# Altium schematic sheet Power Supply.SchDoc: Power Supply
size A4; Organization: Altium Limited; Address1: L3, 12a Rodborough Rd; Address2: Frenchs Forest; Address3: NSW; Address4: Australia 2086; Revision: 1; SheetNumber: 2; SheetTotal: 11; Alumno: Diego Caceres; Curso: R1051; Materia: Sistemas de Representación; Docentes: Ing. Perdomo, Ing. Fuoco, Ing. Giorno, Sr. Vergili
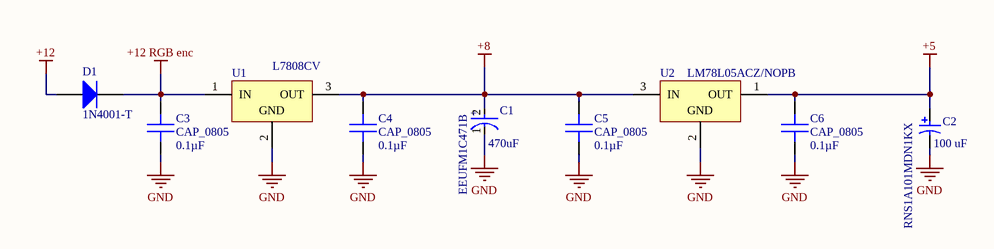
[diagram p0: Power Supply.SchDoc]

## Parts
C1  EEUFM1C471B  Capacitance: 470uF  [FP-RAD-TH-D_10_0_5-L_12_5-MFG]
C2  RNS1A101MDN1KX  Rated Capacitance: 100 uF  [NIC-RNS-8x11.5-2_V]
C3  CAP_0805  value 0.1µF  [0805_CAPACITOR_DCACERES]
C4  CAP_0805  value 0.1µF  [0805_CAPACITOR_DCACERES]
C5  CAP_0805  value 0.1µF  [0805_CAPACITOR_DCACERES]
C6  CAP_0805  value 0.1µF  [0805_CAPACITOR_DCACERES]
D1  1N4001-T  [DIOD-DO-41-P-2_V]
U1  L7808CV  [TO220]
U2  LM78L05ACZ/NOPB  [LP0003A]

## Nets
+5: C2.1 C6.1 U2.1(OUT)
+8: C1.2(A) C4.1 C5.1 U1.3(OUT) U2.3(IN)
+12: D1.1(A)
+12 RGB enc: C3.1 D1.2(K) U1.1(IN)
GND: C1.1(C) C2.2 C3.2 C4.2 C5.2 C6.2 U1.2(GND) U2.2(GND)

## Notes on the sheet
- Title:
- Revision:
- Alumno:
- Materia:
- Docentes:
- Curso:
- File:
- Date:
- Sheet
- of
- (in symbol CMP-05427-001980-1) +

## Library data of the parts
C1 = CMP-05427-001980-1: Aluminum Electrolytic Capacitors (Radial Lead Type) 470uF ±20% 16V; Ripple Current: 1.29A; ESR (Equivalent Series Resistance): 38mR; Life (Hours): 4000Hour; Lead Diameter: 0.6mm; Height: 12.5mm; Package Quantity: 500; Lead Free: Lead Free; Voltage Rating: 16V; Diameter: 10mm; Radiation Hardening: No; Packaging: Tape and Reel; Case/Package: Radial; Tolerance: 20%; Series: FM; Height - Seated (Max): 0.551inch; Max Operating Temperature: 105°C; Termination: Radial; Mount: Through Hole; RoHS Compliant: Yes; Voltage Rating (DC): 16V; Impedance: 38mR; Length: 12.5mm; Lead Pitch: 5mm; Min Operating Temperature: -40°C
C2 = CMP-1235-00001-1: Aluminum Electrolytic Capacitor, 100 uF +/-20%, 10 V, -55 to 105 degC, 2-Pin THD, RoHS; Manufacturer: Nichicon; Rated Ripple: 3900 mA; Rated Voltage: 10 V; Leakage Current: 0.15 mA; Capacitance Tolerance: +/-20%; ComponentLink1URL: http://www.nichicon.co.jp/; ComponentLink3URL: http://www.nichicon.co.jp/english/products/pdf/2013fpcap_catalog_ns.pdf; ComponentLink1Description: Manufacturer URL; ComponentLink2URL: http://www.nichicon.co.jp/english/products/pdfs/e-ns.pdf; PackageDescription: 2-Pin Through Hole Device, Dia 8 mm, Body Length 11.5 mm, Pin Spacing 3.5 mm; Temperature Range: -55 to 105 degC; ComponentLink3Description: Package Specification; PartNumber: RNS1A101MDN1KX; Mounting Technology: Through Hole; DatasheetVersion: Sep-13; RoHS: TRUE; ComponentLink2Description: Datasheet
C3-C6 = CAPACITOR_0805_Caceres: Capacitor SMD, encapsulado 0805; SizePackage: 0805; ComponentLink1Description: Datasheet1; ComponentLink1URL: https://www.mouser.com/datasheet/2/40/AutoMLCCKAM-3216307.pdf; ComponentLink2Description: Datasheet2; ComponentLink2URL: https://www.mouser.com/datasheet/2/447/KEM_C1086_U2J-3316409.pdf; ComponentLink3Description: Datasheet3; ComponentLink3URL: https://product.tdk.com/system/files/dam/doc/product/capacitor/ceramic/mlcc/catalog/mlcc_commercial_soft_en.pdf
D1 = CMP-0639-00006-2: 1.0 A Rectifier, 15 pF, 50 V, -65 to 150 degC, 2-Pin DO-41 Plastic, RoHS, Tape and Reel; Manufacturer: Diodes Inc; VF (V): 1; CT (pF): 15; Max. IR (uA): 5; VRRM (V): 50; Max. IFSM (A): 30; RoHS: TRUE; Mounting Technology: Through Hole; PartNumber: 1N4001-T; ComponentLink2Description: Datasheet; DatasheetVersion: Rev. 8-2; Operating Temperature Range (degC): -65 to 150; Packing: Tape and Reel; PackageReference: DO-41-P-2; ComponentLink1URL: http://diodes.com/; PackageDescription: 2-Pin Axial Lead, Body 4.635 x 2.36 mm, Lead Spread 25.4 mm; ComponentLink2URL: http://diodes.com/datasheets/ds28002.pdf; Max. Average Rectified Current IO (A): 1; ComponentLink1Description: Manufacturer URL
U1 = CMP-0244-00489-1: Positive Voltage Regulator, 8V, 3-Pin TO-220; ComponentLink2Description: Datasheet; ComponentLink1URL: http://www.st.com; ComponentLink2URL: http://www.st.com/internet/com/TECHNICAL_RESOURCES/TECHNICAL_LITERATURE/DATASHEET/CD00000444.pdf; PackageDescription: TO, Thru-Hole, Vertical, Heatsink Mounted; 3 In-Line Leads; Pitch 2.54 mm; ComponentLink3URL: http://www.st.com/internet/com/TECHNICAL_RESOURCES/TECHNICAL_LITERATURE/PACKAGE_INFORMATION/CD00004649.pdf; DatasheetVersion: 16/11/2011; PackageReference: TO220; ComponentLink3Description: Package Specification; PackageVersion: ver3.0; ComponentLink1Description: Manufacturer URL
U2 = CMP-0062-00040-4: 3-Terminal Positive Regulator, 5 Vout, 3-pin TO-92, Pb-Free; Manufacturer: Texas Instruments; High-Reliability: Y; PackageTopMarking: NSXYTT*LM78L*05ACZ; CompType: LDO IC; PowerWise: N; Code_JEDEC: TO-226-AA; ComponentLink1Description: Datasheet URL; PartNumber: LM78L05ACZ/NOPB; RoHS: Y; PinCount: 3; PackageDescription: TO-92, Molded, 3 Lead; ComponentLink1URL: http://www.ti.com/general/docs/lit/getliterature.tsp?genericPartNumber=LM78L05&fileType=pdf; PackageReference: LP0003A